# Altium schematic sheet Level Switch.SchDoc
size A4; SheetNumber: 2; SheetTotal: 2
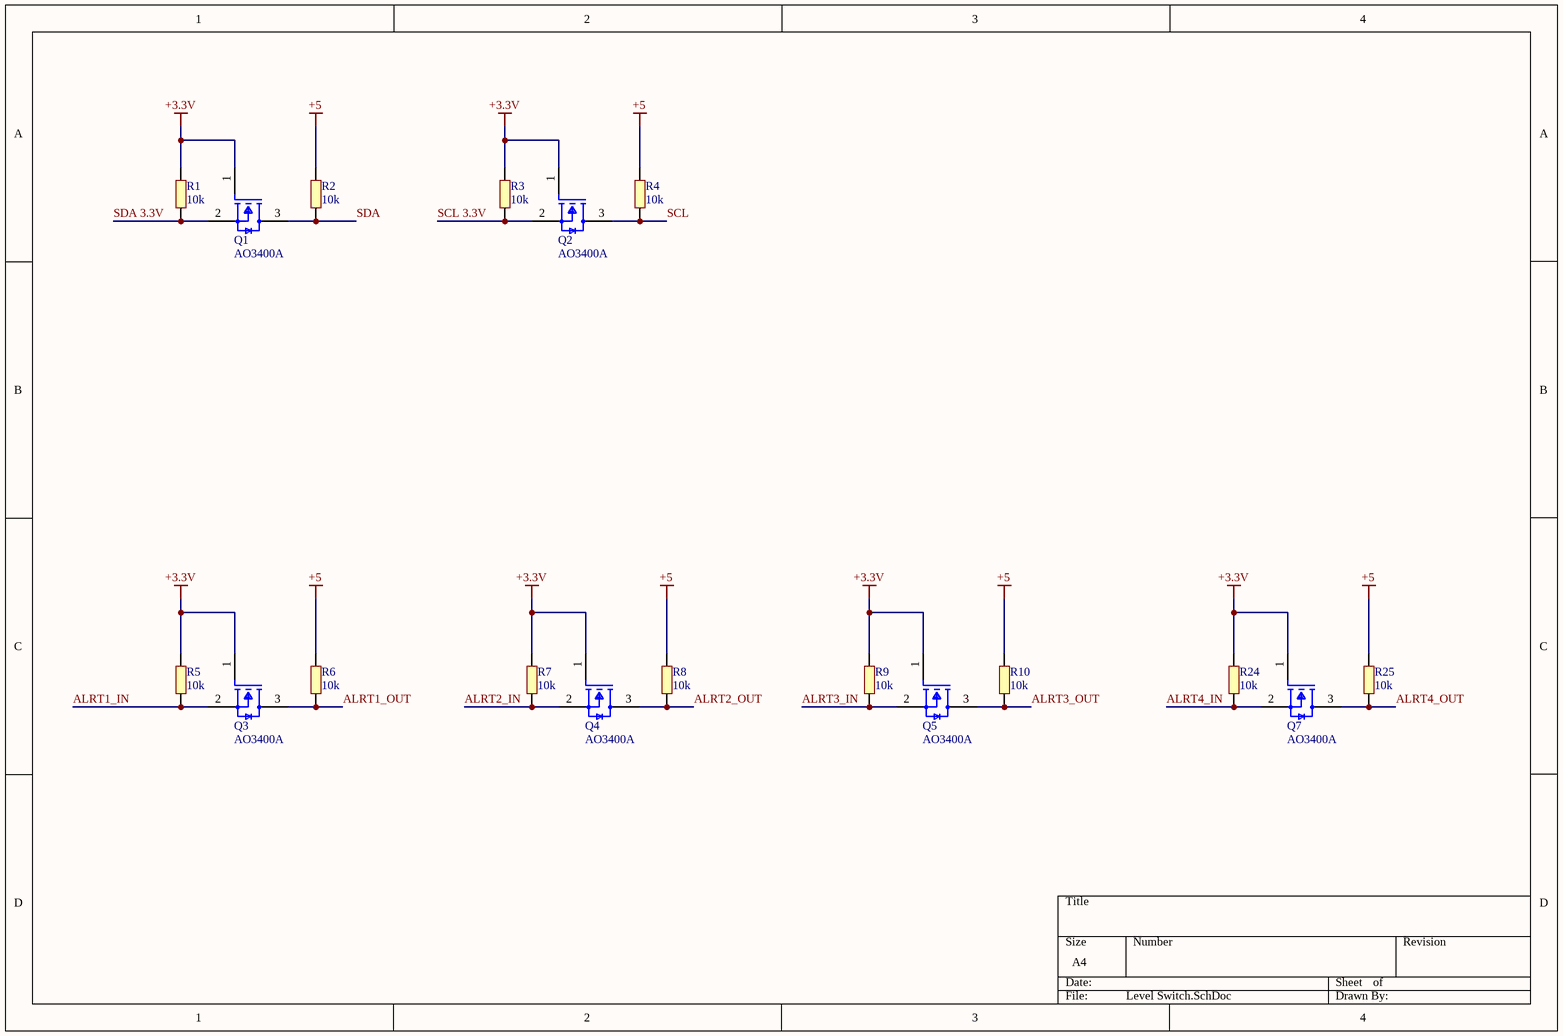
[diagram p0: Level Switch.SchDoc]

## Parts
Q1  AO3400A  [FP-SOT23-MFG]
Q2  AO3400A  [FP-SOT23-MFG]
Q3  AO3400A  [FP-SOT23-MFG]
Q4  AO3400A  [FP-SOT23-MFG]
Q5  AO3400A  [FP-SOT23-MFG]
Q7  AO3400A  [FP-SOT23-MFG]
R1  10k  [Res 0603]
R2  10k  [Res 0603]
R3  10k  [Res 0603]
R4  10k  [Res 0603]
R5  10k  [Res 0603]
R6  10k  [Res 0603]
R7  10k  [Res 0603]
R8  10k  [Res 0603]
R9  10k  [Res 0603]
R10  10k  [Res 0603]
R24  10k  [Res 0603]
R25  10k  [Res 0603]

## Nets
+3.3V: Q1.1(G) Q2.1(G) Q3.1(G) Q4.1(G) Q5.1(G) Q7.1(G) R1.2 R3.2 R5.2 R7.2 R9.2 R24.2
+5: R2.2 R4.2 R6.2 R8.2 R10.2 R25.2
ALRT1_IN: Q3.2(S) R5.1
ALRT1_OUT: Q3.3(D) R6.1
ALRT2_IN: Q4.2(S) R7.1
ALRT2_OUT: Q4.3(D) R8.1
ALRT3_IN: Q5.2(S) R9.1
ALRT3_OUT: Q5.3(D) R10.1
ALRT4_IN: Q7.2(S) R24.1
ALRT4_OUT: Q7.3(D) R25.1
SCL: Q2.3(D) R4.1
SCL 3.3V: Q2.2(S) R3.1
SDA: Q1.3(D) R2.1
SDA 3.3V: Q1.2(S) R1.1

## Library data of the parts
Q1-Q5 Q7 = CMP-83955-000006-1: MOSFET N-CH 30V 5.7A SOT23; Input Capacitance: 630pF; Number of Elements: 1; Rds On Max: 26.5mR; Max Power Dissipation: 1.4W; Gate to Source Voltage (Vgs): 12V; Min Operating Temperature: -55°C; Lead Free: Lead Free; Number of Pins: 3; Drain to Source Voltage (Vdss): 30V; Case/Package: SOT-23; Mount: Surface Mount; Continuous Drain Current (ID): 5.7A; Radiation Hardening: No; Packaging: Tape and Reel; Max Operating Temperature: 150°C; Power Dissipation: 1.4W
R1-R10 R24 R25 = R0603: C25804